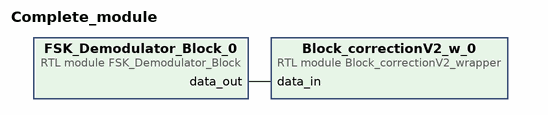
[diagram p0: block diagram of the top level]
# Vivado block design Complete_module, xc7z020clg400-1, Vivado 2023.1
create_bd_design Complete_module

create_bd_cell -type module -reference FSK_Demodulator_Block FSK_Demodulator_Block_0
create_bd_cell -type module -reference Block_correctionV2_wrapper Block_correctionV2_w_0

# ---- connections ----

connect_bd_net [get_bd_pins FSK_Demodulator_Block_0/data_out] [get_bd_pins Block_correctionV2_w_0/data_in]

validate_bd_design
save_bd_design
